# EAGLE schematic Multiplexação (EAGLE 6.6.0)
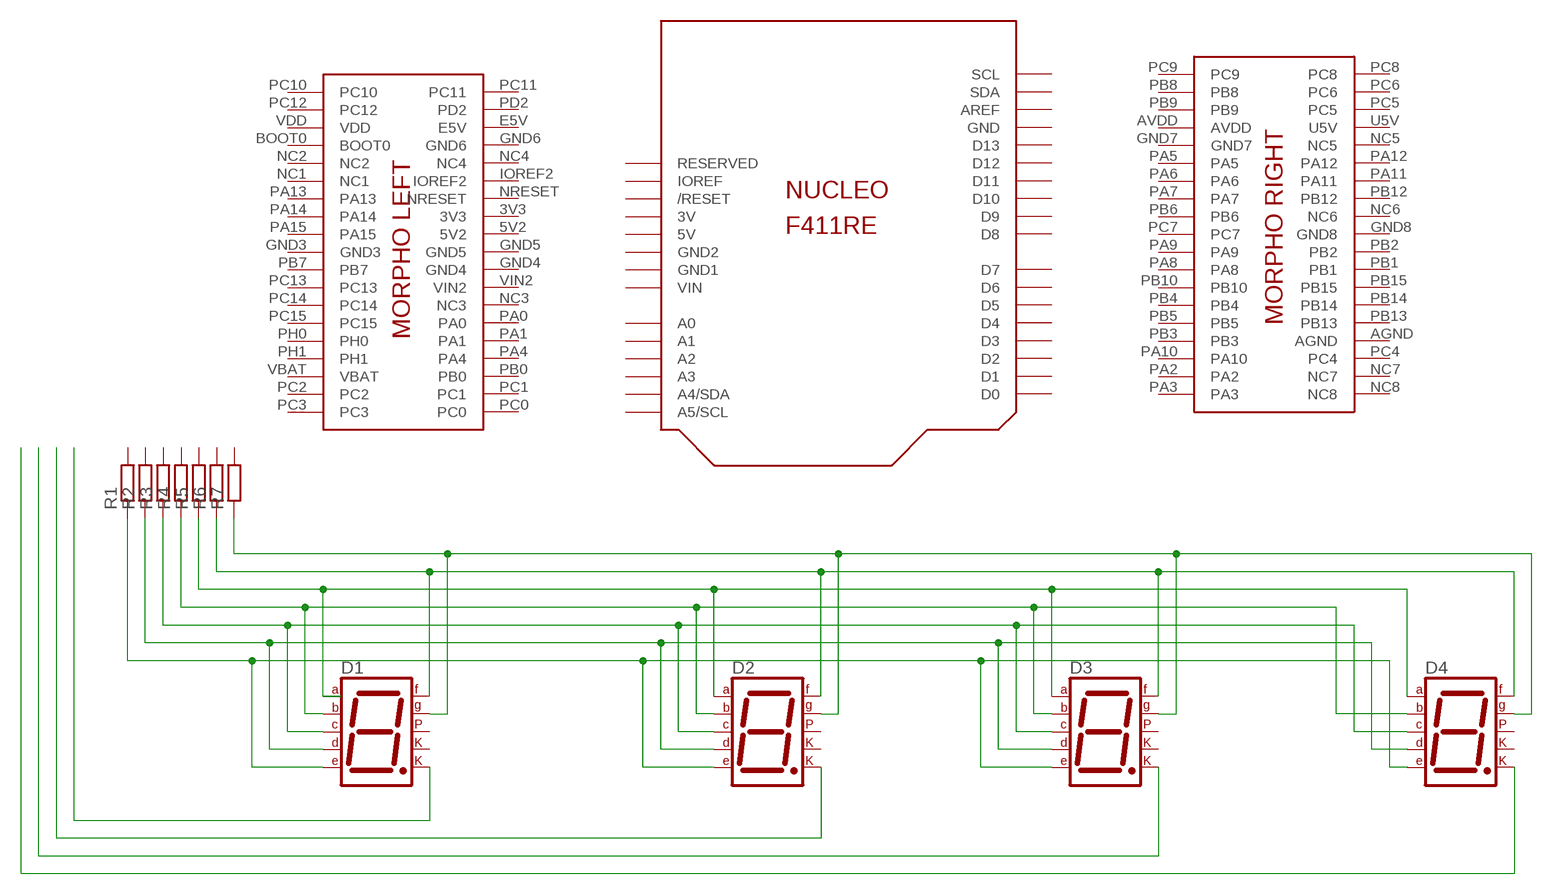
[diagram p0: schematic, sheet 1]

## Parts
D1  7SEG-CK  [7SEG-13]
D2  7SEG-CK  [7SEG-13]
D3  7SEG-CK  [7SEG-13]
D4  7SEG-CK  [7SEG-13]
R1  R-EU_0204/7  [0204/7]
R2  R-EU_0204/7  [0204/7]
R3  R-EU_0204/7  [0204/7]
R4  R-EU_0204/7  [0204/7]
R5  R-EU_0204/7  [0204/7]
R6  R-EU_0204/7  [0204/7]
R7  R-EU_0204/7  [0204/7]
U$1  NUCLEO_F411RE  [NUCLEO_BRD64]

## Nets
N$1: D1.1(E) D2.1(E) D3.1(E) D4.1(E) R1.1
N$2: D1.2(D) D2.2(D) D3.2(D) D4.2(D) R2.1
N$3: D1.4(C) D2.4(C) D3.4(C) D4.4(C) R3.1
N$4: D1.6(B) D2.6(B) D3.6(B) D4.6(B) R4.1
N$5: D2.7(A) D3.7(A) D4.7(A) R5.1
N$6: D1.9(F) D2.9(F) D3.9(F) D4.9(F) R6.1
N$7: D1.10(G) D2.10(G) D3.10(G) D4.10(G) R7.1
N$8: D1.8(CK2)
N$9: D2.8(CK2)
N$10: D3.8(CK2)
N$11: D4.8(CK2)
Unconnected: D1.3(CK1) D1.5(DP) D1.7(A) D2.3(CK1) D2.5(DP) D3.3(CK1) D3.5(DP) D4.3(CK1) D4.5(DP) R1.2 R2.2 R3.2 R4.2 R5.2 R6.2 R7.2 U$1.A0 U$1.A1 U$1.A2 U$1.A3 U$1.A4(A4/SDA) U$1.A5(A5/SCL) U$1.AREF U$1.BOOT0 U$1.D0 U$1.D1 U$1.D2 U$1.D3 U$1.D4 U$1.D5 U$1.D6 U$1.D7 U$1.D8 U$1.D9 U$1.D10 U$1.D11 U$1.D12 U$1.D13 U$1.IOREF U$1.IOREF2 U$1.NC1 U$1.NC2 U$1.NC3 U$1.NC4 U$1.NC5 U$1.NC6 U$1.NC7 U$1.NC8 U$1.NRESET U$1.PA0 U$1.PA1 U$1.PA2 U$1.PA3 U$1.PA4 U$1.PA5 U$1.PA6 U$1.PA7 U$1.PA8 U$1.PA9 U$1.PA10 U$1.PA11 U$1.PA12 U$1.PA13 U$1.PA14 U$1.PA15 U$1.PB0 U$1.PB1 U$1.PB2 U$1.PB3 U$1.PB4 U$1.PB5 U$1.PB6 U$1.PB7 U$1.PB8 U$1.PB9 U$1.PB10 U$1.PB12 U$1.PB13 U$1.PB14 U$1.PB15 U$1.PC0 U$1.PC1 U$1.PC2 U$1.PC3 U$1.PC4 U$1.PC5 U$1.PC6 U$1.PC7 U$1.PC8 U$1.PC9 U$1.PC10 U$1.PC11 U$1.PC12 U$1.PC13 U$1.PC14 U$1.PC15 U$1.PD2 U$1.PH0 U$1.PH1 U$1.RESERVED U$1.RESET(/RESET) U$1.SCL U$1.SDA

## Power pins joined to a net without a drawn wire
3V: U$1.3V
3V3: U$1.3V3
5V: U$1.5V
5V2: U$1.5V2
AGND: U$1.AGND
AVDD: U$1.AVDD
E5V: U$1.E5V
GND: U$1.GND
GND1: U$1.GND1
GND2: U$1.GND2
GND3: U$1.GND3
GND4: U$1.GND4
GND5: U$1.GND5
GND6: U$1.GND6
GND7: U$1.GND7
GND8: U$1.GND8
U5V: U$1.U5V
VBAT: U$1.VBAT
VDD: U$1.VDD
VIN: U$1.VIN
VIN2: U$1.VIN2

## Library data of the parts
D1-D4 = special:7SEG-CK: 7-segment DISPLAY single cathode, 13 mm
R1-R7 = rcl:R-EU_: RESISTOR, European symbol
U$1 = Stm32nucleo:NUCLEO_F411RE